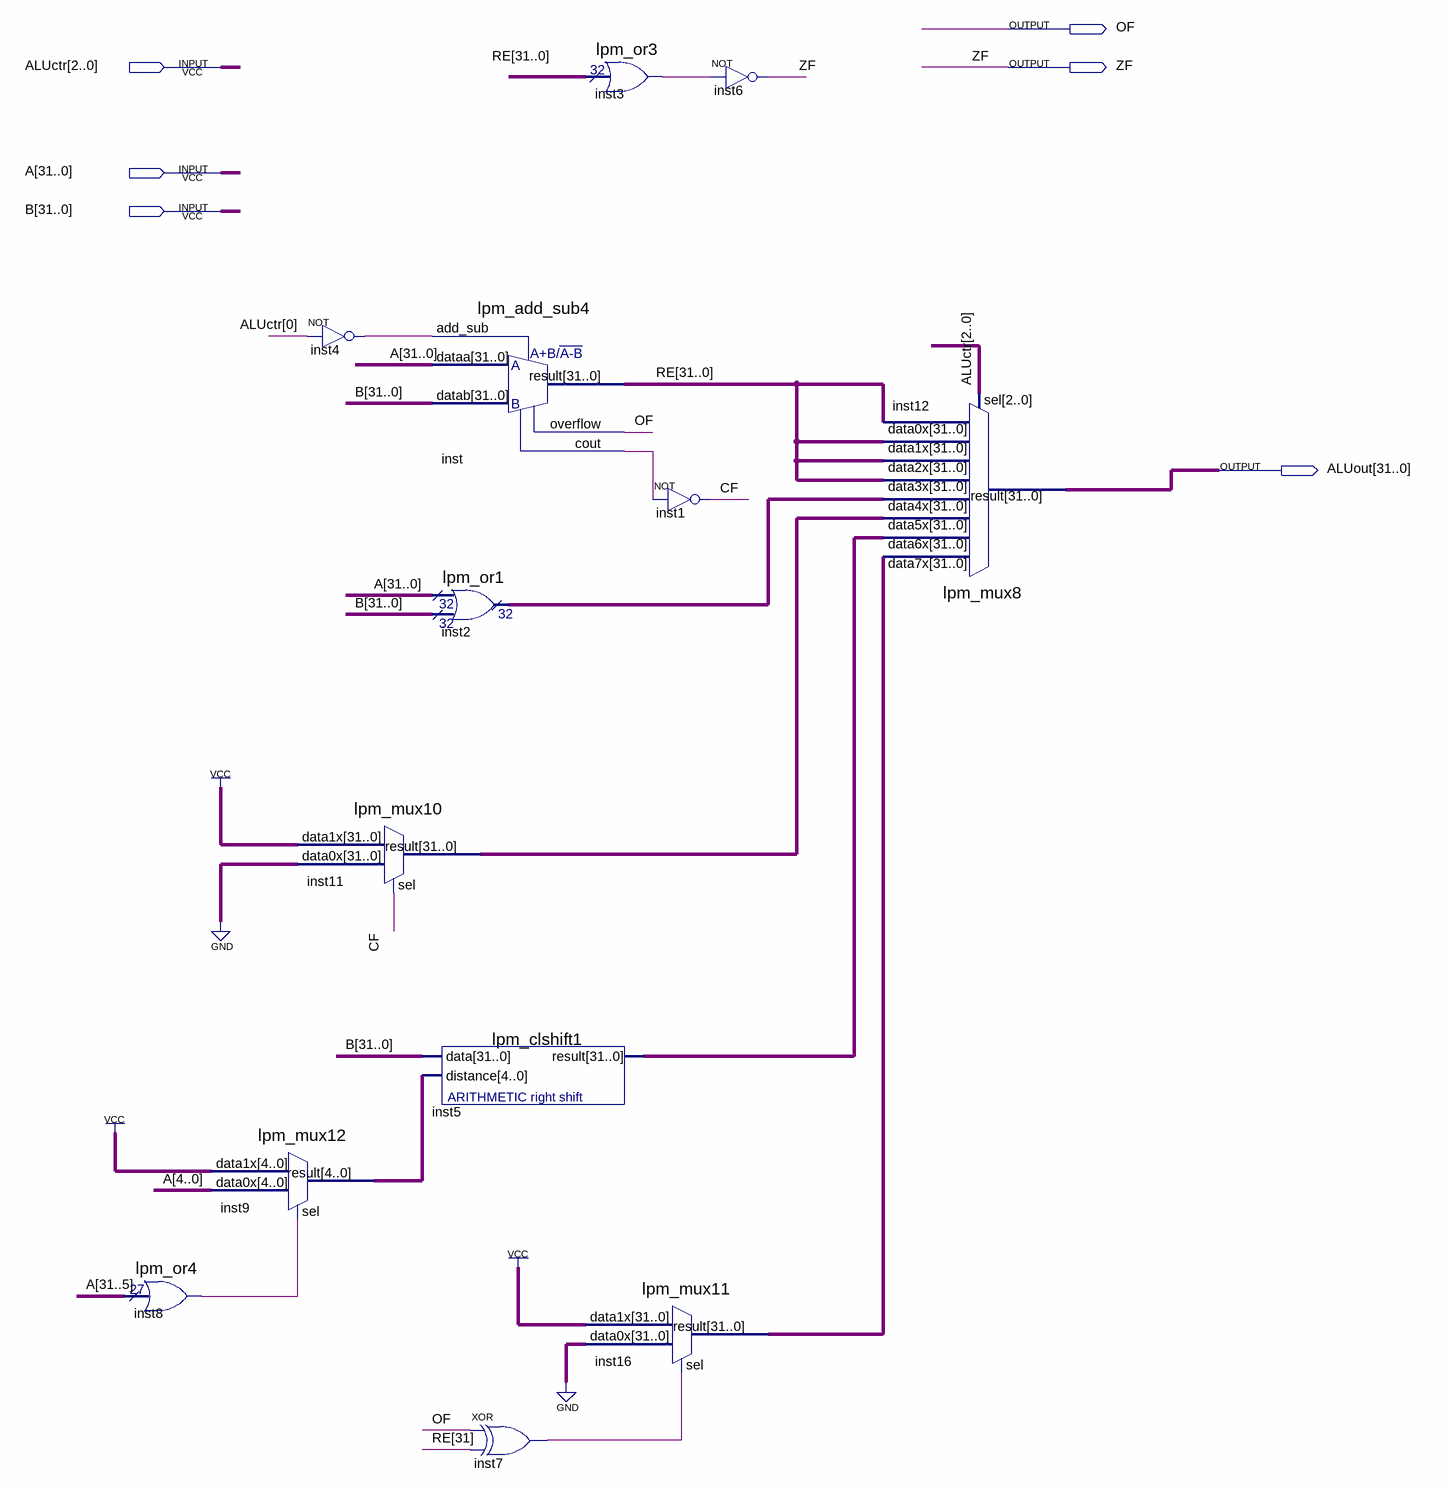
[diagram p0: schematic sheet]
// Quartus schematic ALU.bdf as structural Verilog: 13 symbols, 6 pins
module ALU (
  input  [2:0] ALUctr,
  input  [31:0] A,
  input  [31:0] B,
  output OF,
  output ZF,
  output [31:0] ALUout
);

  wire CF, inst3_result, inst4_out, inst7_out, inst8_result, inst_cout;
  wire [4:0] inst9_result;
  wire [31:0] inst2_result, inst5_result, inst11_result, inst16_result, RE;

  lpm_or4 inst8 (.data(A[31:5]), .result(inst8_result));
  lpm_mux12 inst9 (.data1x({5{1'b1}}), .data0x(A[4:0]), .sel(inst8_result), .result(inst9_result));
  not inst4 (inst4_out, ALUctr[0]);
  lpm_mux10 inst11 (.data1x({32{1'b1}}), .data0x({32{1'b0}}), .sel(CF), .result(inst11_result));
  lpm_add_sub4 inst (.dataa(A), .datab(B), .add_sub(inst4_out), .result(RE), .overflow(OF), .cout(inst_cout));
  lpm_or1 inst2 (.data0x(A), .data1x(B), .result(inst2_result));
  lpm_clshift1 inst5 (.data(B), .distance(inst9_result), .result(inst5_result));
  xor inst7 (inst7_out, OF, RE[31]);
  lpm_or3 inst3 (.data(RE), .result(inst3_result));
  lpm_mux11 inst16 (.data1x({32{1'b1}}), .data0x({32{1'b0}}), .sel(inst7_out), .result(inst16_result));
  not inst1 (CF, inst_cout);
  not inst6 (ZF, inst3_result);
  lpm_mux8 inst12 (
    .data7x(inst16_result), .data6x(inst5_result), .data5x(inst11_result), .data4x(inst2_result),
    .data3x(RE), .data2x(RE), .data1x(RE), .data0x(RE), .sel(ALUctr), .result(ALUout));
endmodule
